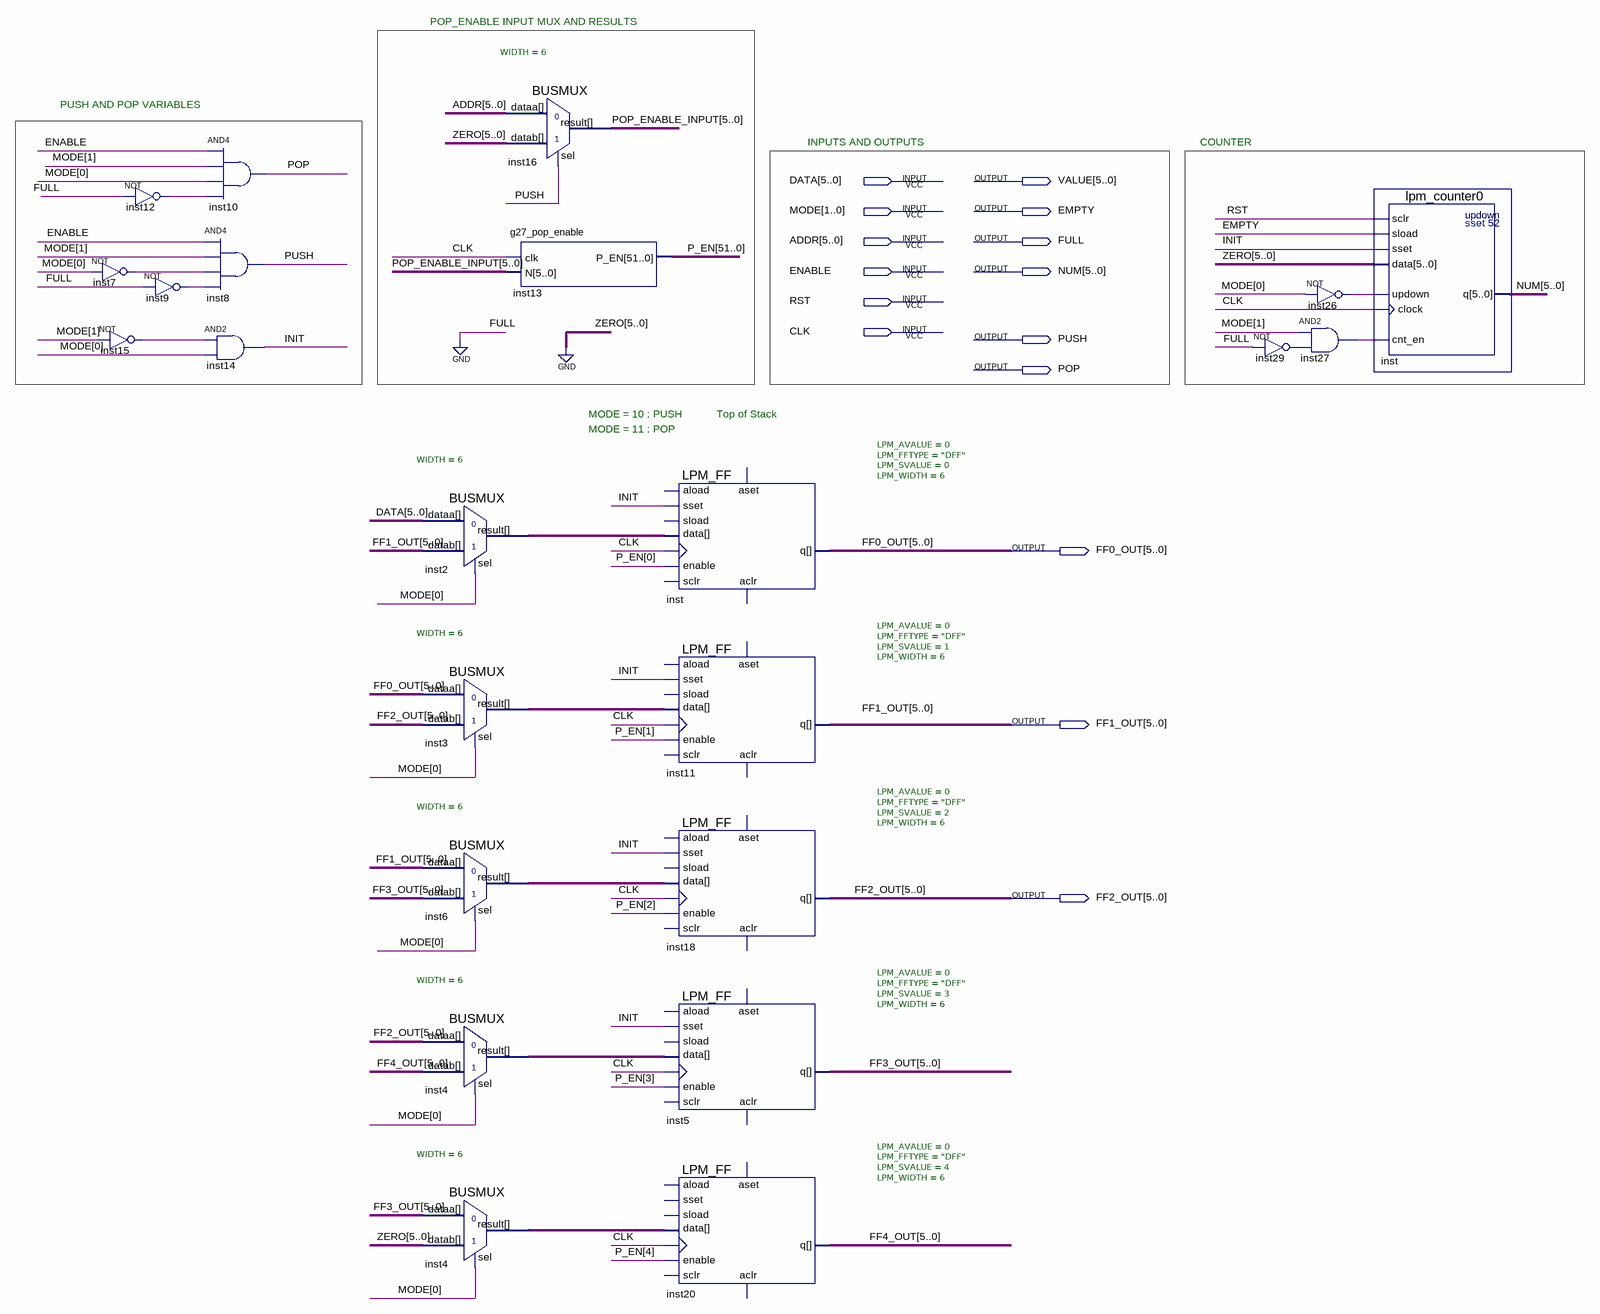
[diagram p0: schematic sheet]
// Quartus schematic g27_stack52 - Backup.bdf as structural Verilog: 23 symbols, 15 pins
module \g27_stack52_-_Backup  (
  input  [5:0] DATA,
  input  [1:0] MODE,
  input  [5:0] ADDR,
  input  ENABLE,
  input  RST,
  input  CLK,
  output [5:0] VALUE,
  output EMPTY,
  output FULL,
  output [5:0] NUM,
  output PUSH,
  output POP,
  output [5:0] FF0_OUT,
  output [5:0] FF1_OUT,
  output [5:0] FF2_OUT
);

  wire INIT, inst7_out, inst9_out, inst12_out, inst15_out, inst26_out, inst27_out, inst29_out;
  wire [5:0] FF3_OUT, FF4_OUT, inst2_result, inst3_result, inst4_result, inst4_result_2, inst6_result,
       POP_ENABLE_INPUT;
  wire [51:0] P_EN;

  not inst12 (inst12_out, 1'b0);
  not inst7 (inst7_out, MODE[0]);
  not inst15 (inst15_out, MODE[1]);
  not inst9 (inst9_out, 1'b0);
  and inst10 (POP, ENABLE, MODE[1], MODE[0], inst12_out);
  and inst8 (PUSH, ENABLE, MODE[1], inst7_out, inst9_out);
  and inst14 (INIT, inst15_out, MODE[0]);
  BUSMUX #(.WIDTH(6)) inst2 (.datab(FF1_OUT), .sel(MODE[0]), .dataa(DATA), .result(inst2_result));
  BUSMUX #(.WIDTH(6)) inst3 (.datab(FF2_OUT), .sel(MODE[0]), .dataa(FF0_OUT), .result(inst3_result));
  BUSMUX #(.WIDTH(6)) inst6 (.datab(FF3_OUT), .sel(MODE[0]), .dataa(FF1_OUT), .result(inst6_result));
  BUSMUX #(.WIDTH(6)) inst4 (.datab(FF4_OUT), .sel(MODE[0]), .dataa(FF2_OUT), .result(inst4_result));
  BUSMUX #(.WIDTH(6)) inst4_dup2 (.datab({6{1'b0}}), .sel(MODE[0]), .dataa(FF3_OUT), .result(inst4_result_2));
  BUSMUX #(.WIDTH(6)) inst16 (.datab({6{1'b0}}), .sel(PUSH), .dataa(ADDR), .result(POP_ENABLE_INPUT));
  g27_pop_enable inst13 (.clk(CLK), .N(POP_ENABLE_INPUT), .P_EN(P_EN));
  LPM_FF #(.LPM_AVALUE(0), .LPM_FFTYPE("DFF"), .LPM_SVALUE(0), .LPM_WIDTH(6)) inst (
    .enable(P_EN[0]), .clock(CLK), .sset(INIT), .data(inst2_result), .q(FF0_OUT));  // open: aload, sload, aset, sclr, aclr
  LPM_FF #(.LPM_AVALUE(0), .LPM_FFTYPE("DFF"), .LPM_SVALUE(1), .LPM_WIDTH(6)) inst11 (
    .enable(P_EN[1]), .clock(CLK), .sset(INIT), .data(inst3_result), .q(FF1_OUT));  // open: aload, sload, aset, sclr, aclr
  LPM_FF #(.LPM_AVALUE(0), .LPM_FFTYPE("DFF"), .LPM_SVALUE(2), .LPM_WIDTH(6)) inst18 (
    .enable(P_EN[2]), .clock(CLK), .sset(INIT), .data(inst6_result), .q(FF2_OUT));  // open: aload, sload, aset, sclr, aclr
  LPM_FF #(.LPM_AVALUE(0), .LPM_FFTYPE("DFF"), .LPM_SVALUE(3), .LPM_WIDTH(6)) inst5 (
    .enable(P_EN[3]), .clock(CLK), .sset(INIT), .data(inst4_result), .q(FF3_OUT));  // open: aload, sload, aset, sclr, aclr
  LPM_FF #(.LPM_AVALUE(0), .LPM_FFTYPE("DFF"), .LPM_SVALUE(4), .LPM_WIDTH(6)) inst20 (
    .enable(P_EN[4]), .clock(CLK), .data(inst4_result_2), .q(FF4_OUT));  // open: aload, sset, sload, aset, sclr, aclr
  not inst29 (inst29_out, 1'b0);
  not inst26 (inst26_out, MODE[0]);
  and inst27 (inst27_out, MODE[1], inst29_out);
  lpm_counter0 inst_dup2 (
    .sclr(RST), .sload(EMPTY), .data({6{1'b0}}), .sset(INIT), .updown(inst26_out), .clock(CLK),
    .cnt_en(inst27_out), .q(NUM));

  assign FULL = 1'b0;

  // Notes on the sheet:
  //   POP_ENABLE INPUT MUX AND RESULTS
  //   PUSH AND POP VARIABLES
  //   INPUTS AND OUTPUTS
  //   COUNTER
  //   MODE = 10 : PUSH
  //   Top of Stack
  //   MODE = 11 : POP
endmodule
